# EAGLE design FIRE EXT (EAGLE 5.11)
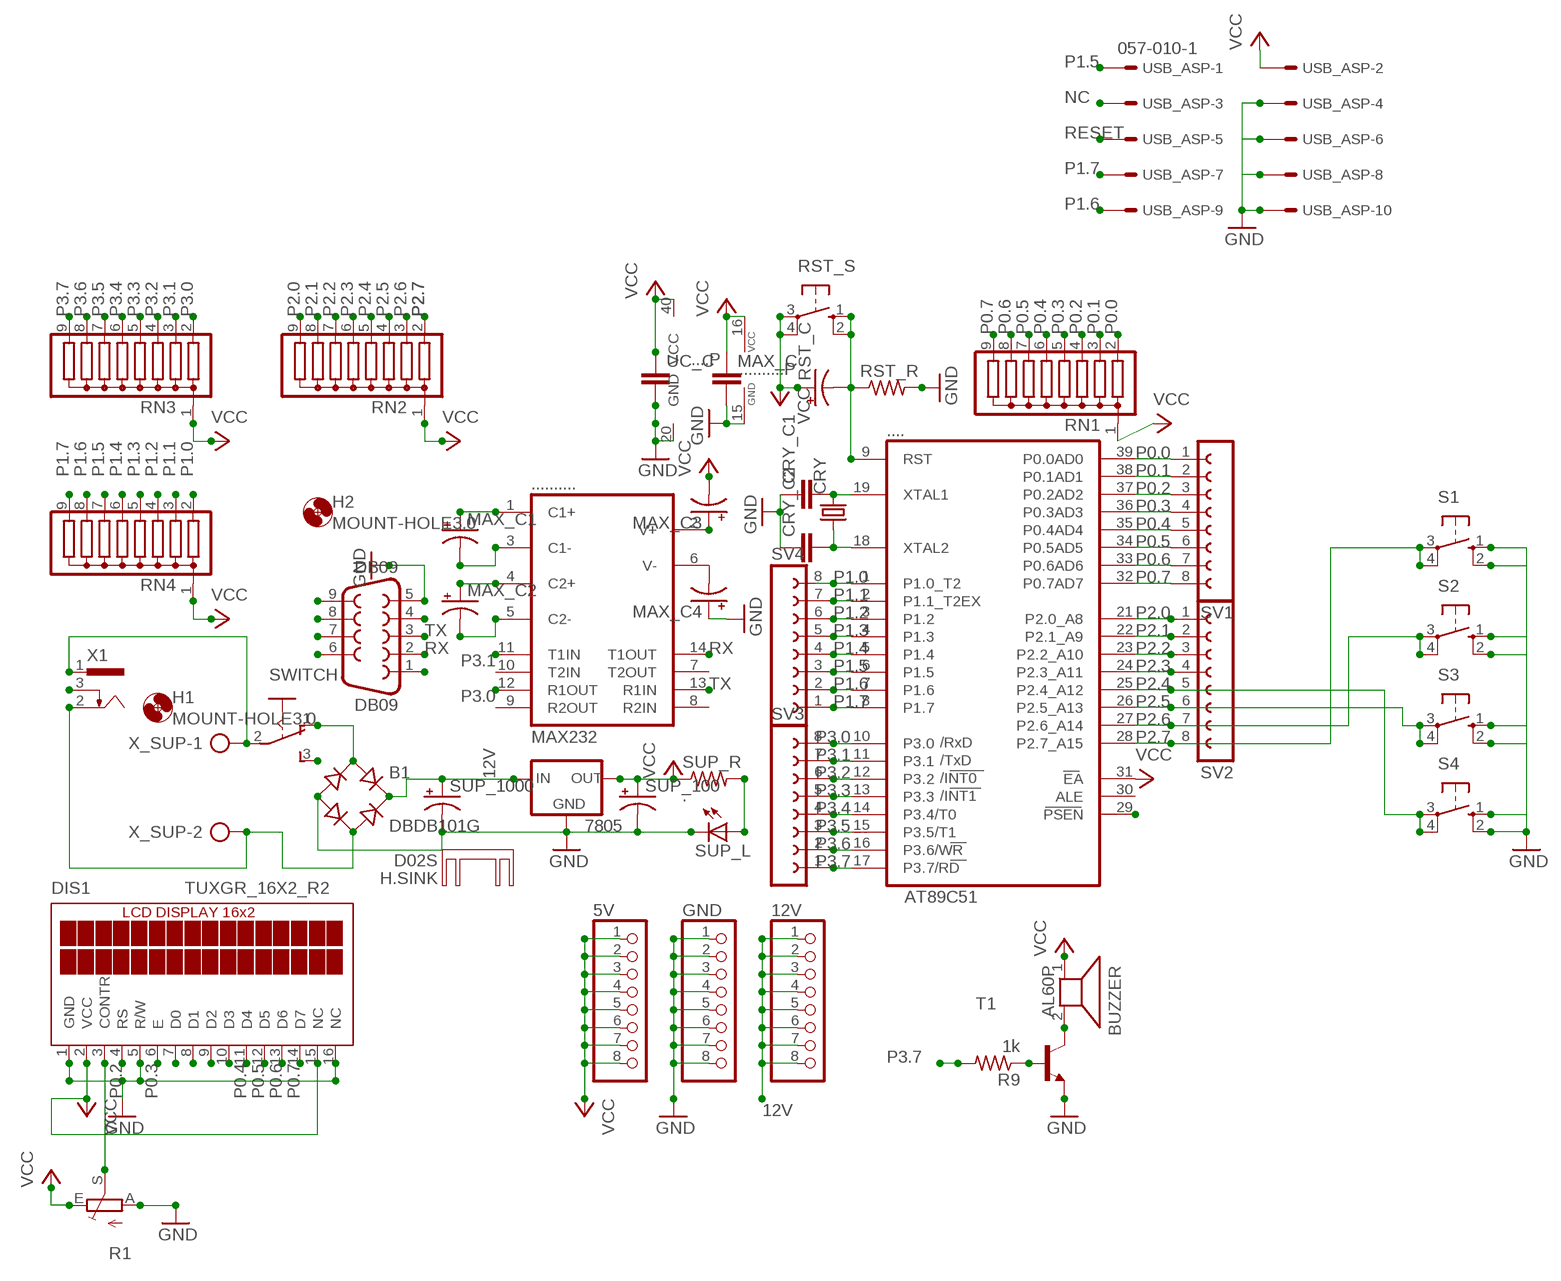
[diagram p0: schematic, sheet 1]

## Parts
5V  PINHD-1X8  [1X08]
12V  PINHD-1X8  [1X08]
7805  78XXS  [78XXS]
....  AT89C51  AT89C52P6  [DIL40]
..........  MAX232  [DIL16]
B1  DBDB101G  [DB]
BUZZER  AL60P  [AL60P]
CRY  CRYTALHC49U70  [HC49U70]
CRY_C1  C-EU025-024X044  [C025-024X044]
CRY_C2  C-EU025-024X044  [C025-024X044]
DB09  DB09  F09HP  [F09HP]
DIS1  TUXGR_16X2_R2  [TUXGR_16X2_R2]
GND  PINHD-1X8  [1X08]
H1  MOUNT-HOLE3.0  [3,0]
H2  MOUNT-HOLE3.0  [3,0]
H.SINK  D02S  [D02S]
MAX_C  C-EU025-025X050  [C025-025X050]
MAX_C1  CPOL-USE2-5  [E2-5]
MAX_C2  CPOL-USE2-5  [E2-5]
MAX_C3  CPOL-USE2-5  [E2-5]
MAX_C4  CPOL-USE2-5  [E2-5]
R1  TRIM_EU-CA9V  [CA9V]
R9  1k  R-US_0204/7  [0204/7]
RN1  G08R  [SIL9]
RN2  G08R  [SIL9]
RN3  G08R  [SIL9]
RN4  G08R  [SIL9]
RST_C  CPOL-USE2-5  [E2-5]
RST_R  R-US_0207/10  [0207/10]
RST_S  10-XX  [B3F-10XX]
S1  10-XX  [B3F-10XX]
S2  10-XX  [B3F-10XX]
S3  10-XX  [B3F-10XX]
S4  10-XX  [B3F-10XX]
SUP_100  CPOL-USE2-5  [E2-5]
SUP_1000  CPOL-USE3.5-10  [E3,5-10]
SUP_L  LED3MM  [LED3MM]
SUP_R  .  R-US_0207/10  [0207/10]
SV1  FE08-1  [FE08]
SV2  FE08-1  [FE08]
SV3  FE08-1  [FE08]
SV4  FE08-1  [FE08]
SWITCH  M251  [M251]
T1  -NPN-TO92  [TO92]
UC_C  C-EU025-025X050  [C025-025X050]
USB_ASP  057-010-1  [057-010-1]
X1  733980-62  [733980-62]
X_SUP  AK300/2  [AK300/2]

## Nets
12V: 12V.1 12V.2 12V.3 12V.4 12V.5 12V.6 12V.7 12V.8 7805.IN B1.+ SUP_1000.+
GND: 7805.GND .....20(GND) ...........15(GND) B1.- CRY_C1.1 CRY_C2.1 DB09.5 DIS1.1(GND) DIS1.5(R/W) DIS1.16(NC) GND.1 GND.2 GND.3 GND.4 GND.5 GND.6 GND.7 GND.8 MAX_C4.+ MAX_C.2 R1.A RST_R.2 S1.1(S) S1.2(S1) S2.1(S) S2.2(S1) S3.1(S) S3.2(S1) S4.1(S) S4.2(S1) SUP_100.- SUP_1000.- SUP_L.K(C) T1.1(E) UC_C.2 USB_ASP.4 USB_ASP.6 USB_ASP.8 USB_ASP.10
N$1: R9.1 T1.2(B)
N$3: BUZZER.2 T1.3(C)
N$4: ...........1(C1+) MAX_C1.+
N$5: DB09.4
N$6: DB09.1
N$7: SUP_L.A SUP_R.2
N$8: DB09.6
N$9: ...........3(C1-) MAX_C1.-
N$10: ...........4(C2+) MAX_C2.+
N$11: ...........5(C2-) MAX_C2.-
N$12: ...........2(V+) MAX_C3.+
N$13: ...........6(V-) MAX_C4.-
N$14: DB09.8
N$15: .....19(XTAL1) CRY.2 CRY_C1.2
N$16: .....18(XTAL2) CRY.1 CRY_C2.2
N$17: DB09.7
N$18: DB09.9
N$19: DIS1.7(D0)
N$20: DIS1.8(D1)
N$21: DIS1.9(D2)
N$22: DIS1.3(CONTR) R1.S
N$23: DIS1.10(D3)
N$24: SWITCH.2(P) X1.1 X_SUP.1
N$25: X1.3
N$26: B1.AC2 X1.2 X_SUP.2
N$27: B1.AC1 SWITCH.1(O)
N$28: SWITCH.3(S)
NC: USB_ASP.3
P0.0: .....39(P0.0AD0) RN1.2 SV1.1
P0.1: .....38(P0.1AD1) RN1.3 SV1.2
P0.2: .....37(P0.2AD2) DIS1.4(RS) RN1.4 SV1.3
P0.3: .....36(P0.3AD3) DIS1.6(E) RN1.5 SV1.4
P0.4: .....35(P0.4AD4) DIS1.11(D4) RN1.6 SV1.5
P0.5: .....34(P0.5AD5) DIS1.12(D5) RN1.7 SV1.6
P0.6: .....33(P0.6AD6) DIS1.13(D6) RN1.8 SV1.7
P0.7: .....32(P0.7AD7) DIS1.14(D7) RN1.9 SV1.8
P1.0: .....1(P1.0_T2) RN4.2 SV4.8
P1.1: .....2(P1.1_T2EX) RN4.3 SV4.7
P1.2: .....3(P1.2) RN4.4 SV4.6
P1.3: .....4(P1.3) RN4.5 SV4.5
P1.4: .....5(P1.4) RN4.6 SV4.4
P1.5: .....6(P1.5) RN4.7 SV4.3 USB_ASP.1
P1.6: .....7(P1.6) RN4.8 SV4.2 USB_ASP.9
P1.7: .....8(P1.7) RN4.9 SV4.1 USB_ASP.7
P2.0: .....21(P2.0_A8) RN2.9 SV2.1
P2.1: .....22(P2.1_A9) RN2.8 SV2.2
P2.2: .....23(P2.2_A10) RN2.7 SV2.3
P2.3: .....24(P2.3_A11) RN2.6 SV2.4
P2.4: .....25(P2.4_A12) RN2.5 S4.3(P) S4.4(P1) SV2.5
P2.5: .....26(P2.5_A13) RN2.4 S3.3(P) S3.4(P1) SV2.6
P2.6: .....27(P2.6_A14) RN2.3 S2.3(P) S2.4(P1) SV2.7
P2.7: .....28(P2.7_A15) RN2.2 S1.3(P) S1.4(P1) SV2.8
P3.0: .....10(P3.0) ...........12(R1OUT) RN3.2 SV3.8
P3.1: .....11(P3.1) ...........11(T1IN) RN3.3 SV3.7
P3.2: .....12(P3.2) RN3.4 SV3.6
P3.3: .....13(P3.3) RN3.5 SV3.5
P3.4: .....14(P3.4/T0) RN3.6 SV3.4
P3.5: .....15(P3.5/T1) RN3.7 SV3.3
P3.6: .....16(P3.6/WR) RN3.8 SV3.2
P3.7: .....17(P3.7/RD) R9.2 RN3.9 SV3.1
PSEN: .....29(PSEN)
RESET: .....9(RST) RST_C.- RST_R.1 RST_S.1(S) RST_S.2(S1) USB_ASP.5
RX: ...........14(T1OUT) DB09.2
TX: ...........13(R1IN) DB09.3
VCC: 5V.1 5V.2 5V.3 5V.4 5V.5 5V.6 5V.7 5V.8 7805.OUT .....31(EA) .....40(VCC) ...........16(VCC) BUZZER.1 DIS1.2(VCC) DIS1.15(NC) MAX_C3.- MAX_C.1 R1.E RN1.1 RN2.1 RN3.1 RN4.1 RST_C.+ RST_S.3(P) RST_S.4(P1) SUP_100.+ SUP_R.1 UC_C.1 USB_ASP.2
Unconnected: .....30(ALE) ...........7(T2OUT) ...........8(R2IN) ...........9(R2OUT) ...........10(T2IN)

## Library data of the parts
5V 12V GND = pinhead:PINHD-1X8: PIN HEADER
7805 = v-reg:78XXS: VOLTAGE REGULATOR
.... = atmel:AT89C*52: MICROCONTROLLER 8 Kbytes FLASH; 2K Bytes EEPROM Compatible with MCS-51 Products at89s8252.pdf; OC_FARNELL: unknown; OC_NEWARK: unknown
.......... = maxim:MAX232: RS232 TRANSEIVER; MF: MAXIM; MPN: MAX232ACPE+; OC_FARNELL: 9723773; OC_NEWARK: 68K4544
B1 = rectifier:DB?*G: Single Phase 1.0 AMP Glass Passivated Bridge Rectifier Taiwan Semiconductor Co.,Ltd. - TSC Source: http://www.taiwansemi.com/TSCbig5/ezcatfiles/cust/img/img/db101g.pdf http://www.ts.com.tw/db/pictures/modules/PDT/PDT060207001/DBLS201G.pdf
BUZZER = buzzer:AL60P: SPEAKER Source: Buerklin
CRY = crystal:CRYTAL: CRYSTAL
CRY_C1 CRY_C2 MAX_C UC_C = rcl:C-EU: CAPACITOR, European symbol
DB09 = con-subd:F09: SUB-D; OC_FARNELL: unknown; OC_NEWARK: unknown
DIS1 = display-lcd:TUXGR_16X2_R2: Tuxgraphics LCD display 16x2 characters reflective, without background light Source: tuxgr_12x2_r2.pdf; OC_FARNELL: unknown; OC_NEWARK: unknown
H1 H2 = holes:MOUNT-HOLE: MOUNTING HOLE with drill center marker
H.SINK = heatsink:D02S: HEATSINK distributor Schukat
MAX_C1-MAX_C4 RST_C SUP_100 SUP_1000 = rcl:CPOL-US: POLARIZED CAPACITOR, American symbol
R1 = pot:TRIM_EU-: POTENTIOMETER
R9 RST_R SUP_R = rcl:R-US_: RESISTOR, American symbol
RN1-RN4 = resistor-sil:G08R: SIL RESISTOR
RST_S S1-S4 = switch-omron:10-XX: OMRON SWITCH; MPN: B3F-1000; OC_FARNELL: 176432; OC_NEWARK: 36M3542
SUP_L = led:LED: LED OSRAM: - CHIPLED LG R971, LG N971, LY N971, LG Q971, LY Q971, LO R971, LY R971 LH N974, LH R974 LS Q976, LO Q976, LY Q976 LO Q996 - Hyper CHIPLED LW Q18S LB Q993, LB Q99A, LB R99A - SideLED LS A670, LO A670, LY A670, LG A670, LP A670 LB A673, LV A673, LT A673, LW A673 LH A674 LY A675 LS A676, LA A676, LO A676, LY A676, LW A676 LS A679, LY A679, LG A679 - Hyper Micro SIDELED® LS Y876, LA Y876, LO Y876, LY Y876 LT Y87S - SmartLED LW L88C, LW L88S LB L89C, LB L89S, LG L890 LS L89K, LO L89K, LY L89K LS L896, LA L896, LO L896, LY L896 - TOPLED LS T670, LO T670, LY T670, LG T670, LP T670 LSG T670, LSP T670, LSY T670, LOP T670, LYG T670 LG T671, LOG T671, LSG T671 LB T673, LV T673, LT T673, LW T673 LH T674 LS T676, LA T676, LO T676, LY T676, LB T676, LH T676, LSB T676, LW T676 LB T67C, LV T67C, LT T67C, LS T67K, LO T67K, LY T67K, LW E67C LS E67B, LA E67B, LO E67B, LY E67B, LB E67C, LV E67C, LT E67C LW T67C LS T679, LY T679, LG T679 LS T770, LO T770, LY T770, LG T770, LP T770 LB T773, LV T773, LT T773, LW T773 LH T774 LS E675, LA E675, LY E675, LS T675 LS T776, LA T776, LO T776, LY T776, LB T776 LHGB T686 LT T68C, LB T68C - Hyper Mini TOPLED® LB M676 - Mini TOPLED Santana® LG M470 LS M47K, LO M47K, LY M47K Source: http://www.osram.convergy.de LUXEON: - LUMILED® LXK2-PW12-R00, LXK2-PW12-S00, LXK2-PW14-U00, LXK2-PW14-V00 LXK2-PM12-R00, LXK2-PM12-S00, LXK2-PM14-U00 LXK2-PE12-Q00, LXK2-PE12-R00, LXK2-PE12-S00, LXK2-PE14-T00, LXK2-PE14-U00 LXK2-PB12-K00, LXK2-PB12-L00, LXK2-PB12-M00, LXK2-PB14-N00, LXK2-PB14-P00, LXK2-PB14-Q00 LXK2-PR12-L00, LXK2-PR12-M00, LXK2-PR14-Q00, LXK2-PR14-R00 LXK2-PD12-Q00, LXK2-PD12-R00, LXK2-PD12-S00 LXK2-PH12-R00, LXK2-PH12-S00 LXK2-PL12-P00, LXK2-PL12-Q00, LXK2-PL12-R00 Source: www.luxeon.com KINGBRIGHT: KA-3528ASYC Source: www.kingbright.com
SV1-SV4 = con-lsta:FE08-1: FEMALE HEADER
SWITCH = switch:M251: SLIDING SWITCH Mors, distributor Buerklin, 11G702
T1 = transistor:*-NPN-: NPN Transistror
USB_ASP = con-panduit:057-010-: CONNECTOR 10-pin series 057 contact pc board low profile headers; OC_FARNELL: unknown; OC_NEWARK: unknown
X1 = con-conrad:73398?: FEMALE PRINT CONNECTOR Niedervolt-Steckverbinder Distributor Conrad
X_SUP = con-ptr500:AK300/2: CONNECTOR

## Board
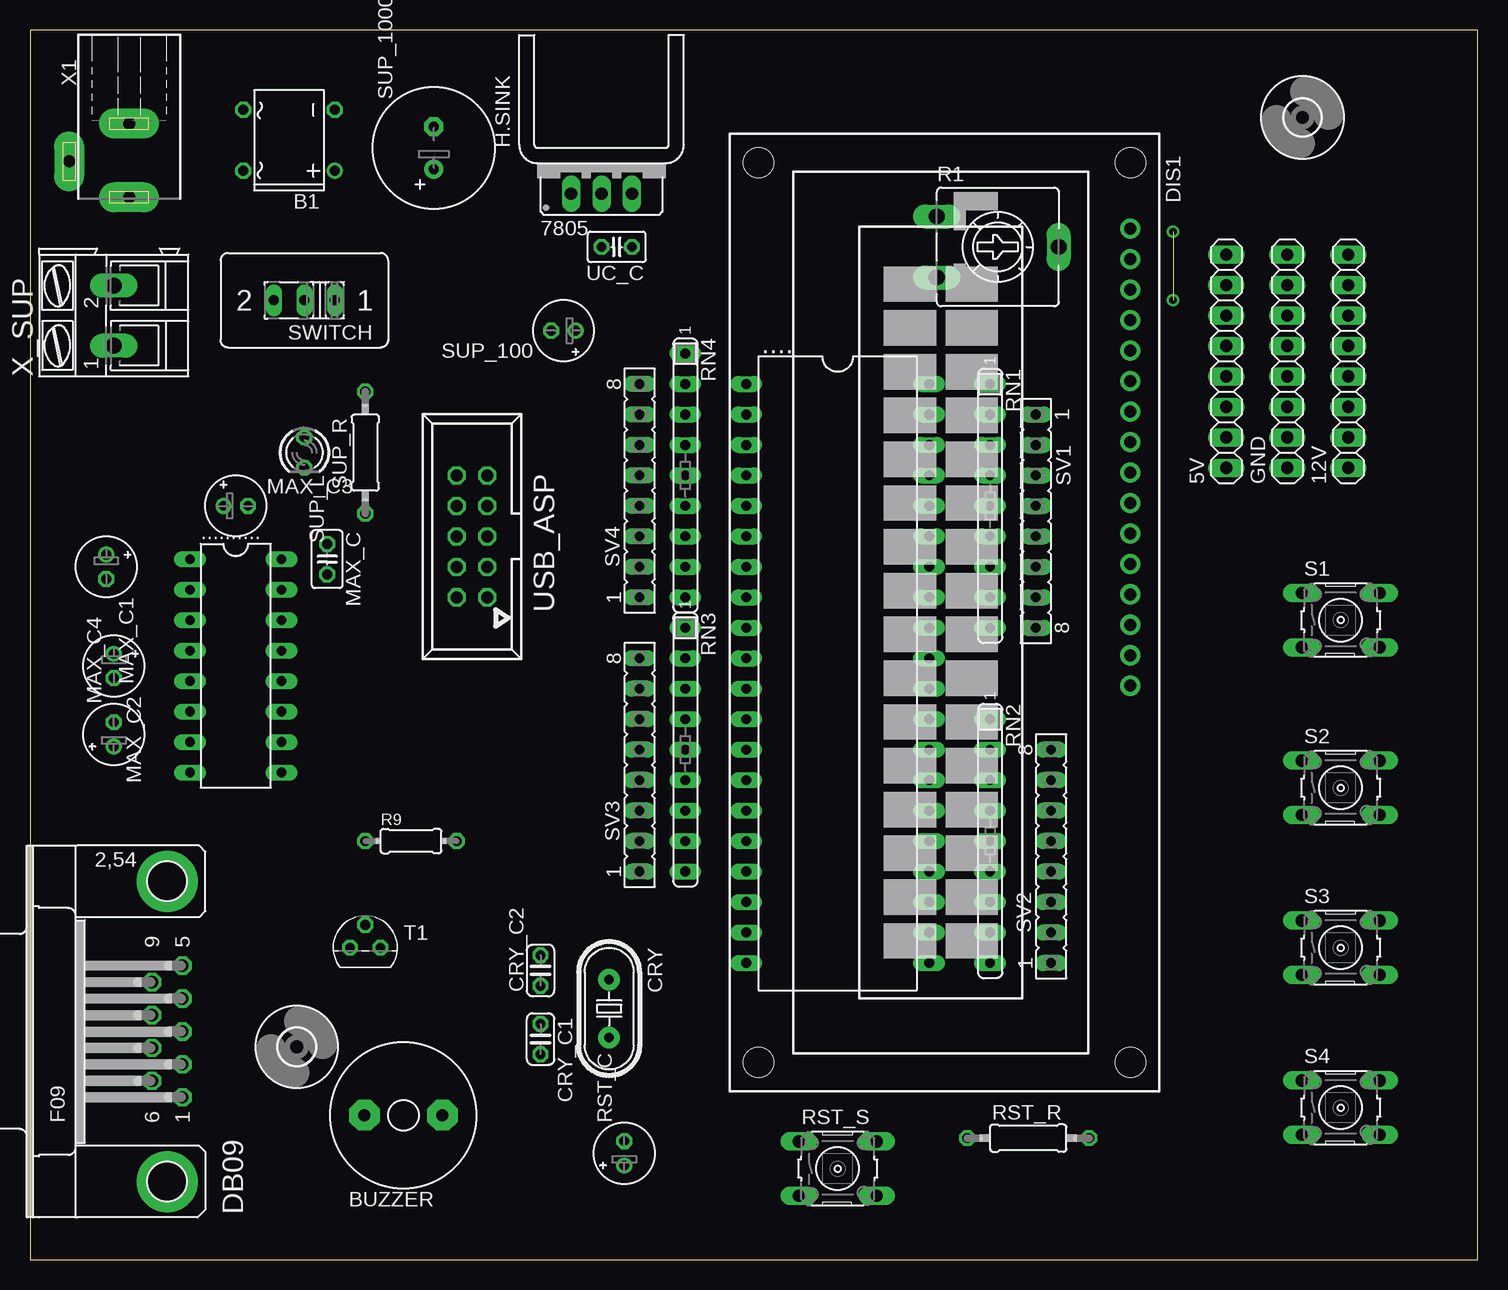
[diagram p1: board, top side]
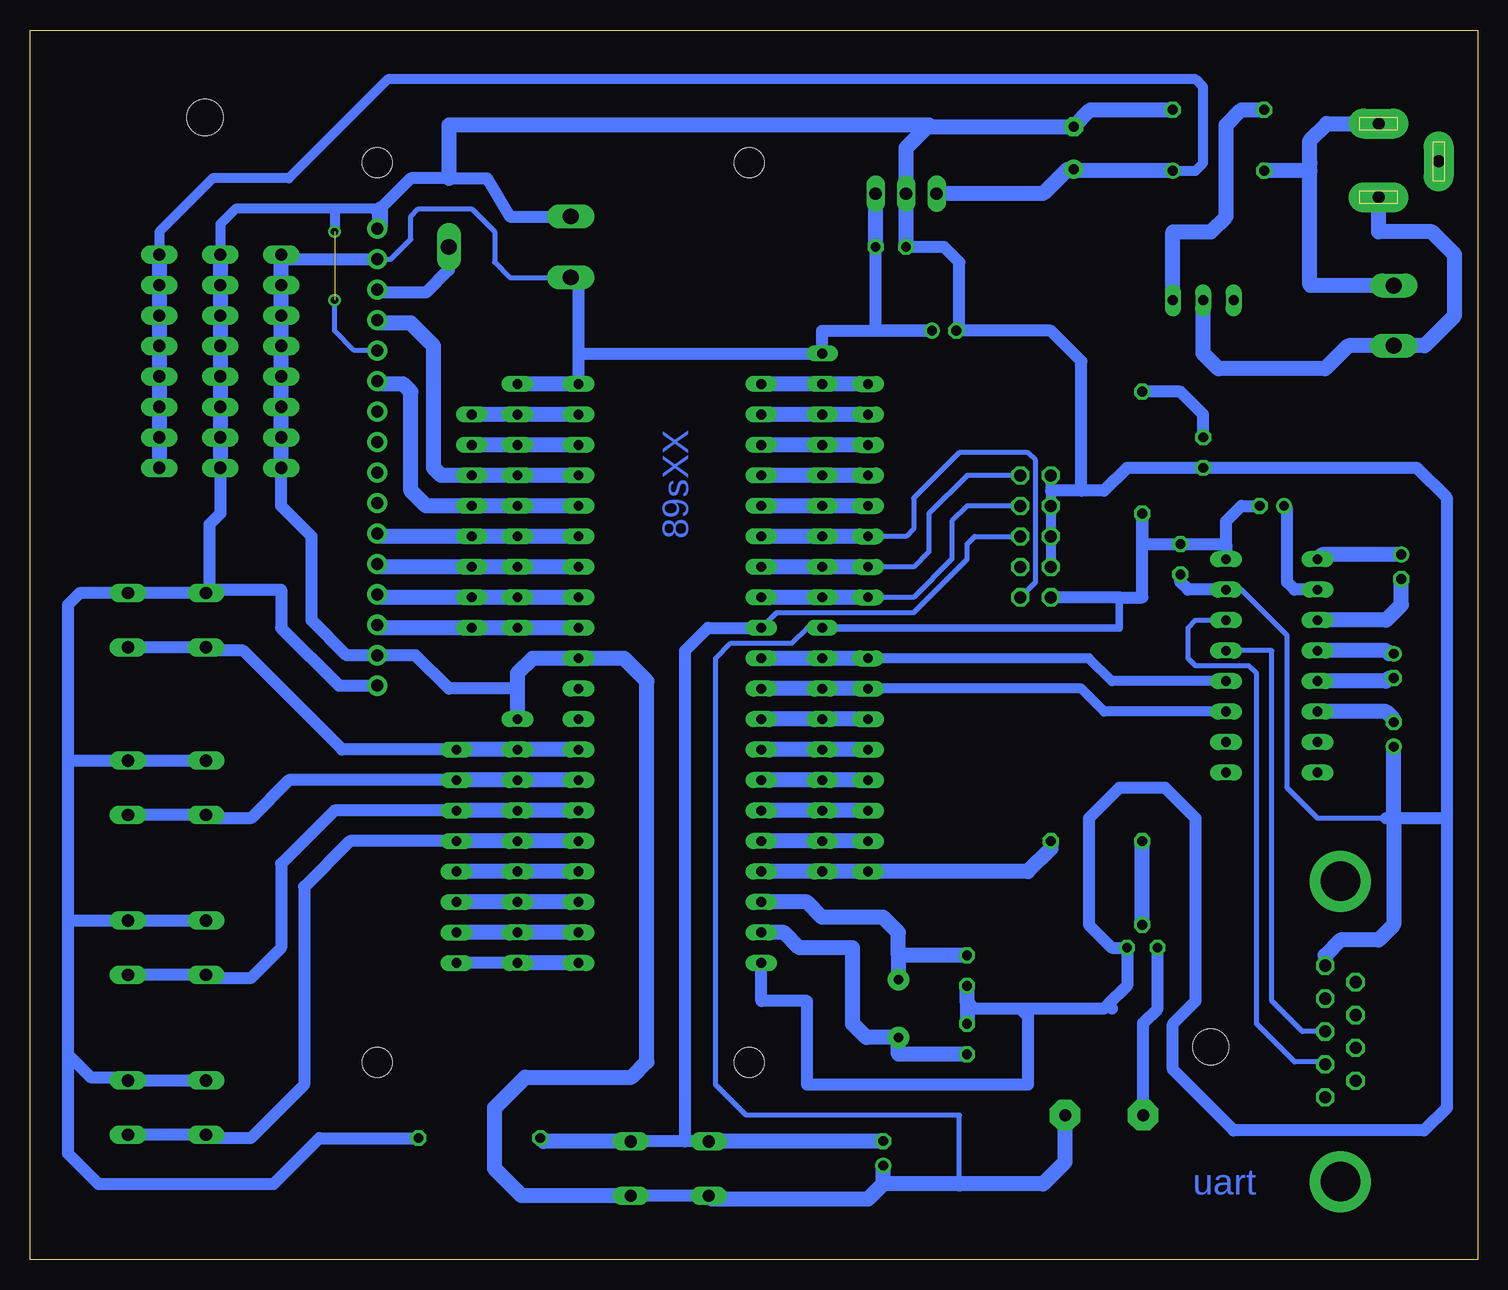
[diagram p2: board, bottom side, seen from below]

Size 120.63 x 102.54 mm. Coordinates in mm from the lower left corner, seen from the top.
Outline: 0,0 120.63,0 120.63,102.54 0,102.54 0,0
Copper layers (1*16): Top 0.035mm / dielectric 1.5mm / Bottom 0.035mm
Design rules "default *": minimum track width 22mil, minimum drill 24mil, track to track 12mil, track to pad 12mil, pad to pad 12mil, via to via 8mil, smd to smd 8mil, copper to edge 40mil, drill to drill 8mil, minimum pad ring 10mil, minimum via ring 8mil, stop-mask expansion 4mil, vias tented up to drill 0mil, thermal gap 10mil

### Footprints (pad centres in the part's own frame; a part is rotated, then mirrored left to right if it is on the bottom)
1X08 = drill 1.016 long: 1 -8.89,0; 2 -6.35,0; 3 -3.81,0; 4 -1.27,0; 5 1.27,0; 6 3.81,0; 7 6.35,0; 8 8.89,0
78XXS = drill 1.016 long: GND 0,-2.54; IN -2.54,-2.54; OUT 2.54,-2.54
DIL40 = drill 0.813 long: 1 -24.13,-7.62; 2 -21.59,-7.62; 3 -19.05,-7.62; 4 -16.51,-7.62; 5 -13.97,-7.62; 6 -11.43,-7.62; 7 -8.89,-7.62; 8 -6.35,-7.62; 9 -3.81,-7.62; 10 -1.27,-7.62; 11 1.27,-7.62; 12 3.81,-7.62; 13 6.35,-7.62; 14 8.89,-7.62; 15 11.43,-7.62; 16 13.97,-7.62; 17 16.51,-7.62; 18 19.05,-7.62; 19 21.59,-7.62; 20 24.13,-7.62; 21 24.13,7.62; 22 21.59,7.62; 23 19.05,7.62; 24 16.51,7.62; 25 13.97,7.62; 26 11.43,7.62; 27 8.89,7.62; 28 6.35,7.62; 29 3.81,7.62; 30 1.27,7.62; 31 -1.27,7.62; 32 -3.81,7.62; 33 -6.35,7.62; 34 -8.89,7.62; 35 -11.43,7.62; 36 -13.97,7.62; 37 -16.51,7.62; 38 -19.05,7.62; 39 -21.59,7.62; 40 -24.13,7.62
DIL16 = drill 0.813 long: 1 -8.89,-3.81; 2 -6.35,-3.81; 3 -3.81,-3.81; 4 -1.27,-3.81; 5 1.27,-3.81; 6 3.81,-3.81; 7 6.35,-3.81; 8 8.89,-3.81; 9 8.89,3.81; 10 6.35,3.81; 11 3.81,3.81; 12 1.27,3.81; 13 -1.27,3.81; 14 -3.81,3.81; 15 -6.35,3.81; 16 -8.89,3.81
DB = drill 0.813 round: + -2.54,-3.81 | drill 0.813 octagon: - 2.54,-3.81; AC1 2.54,3.81; AC2 -2.54,3.81
AL60P = drill 1.016 pad 2.54 octagon: 1 -3.251,0; 2 3.251,0
HC49U70 = drill 0.813 pad 1.778 round: 1 -2.413,0; 2 2.413,0
C025-024X044 = drill 0.813 octagon: 1 -1.27,0; 2 1.27,0
F09HP = drill 1.016 octagon: 1 -5.486,-1.27; 2 -2.743,-1.27; 3 0,-1.27; 4 2.743,-1.27; 5 5.486,-1.27; 6 -4.115,1.27; 7 -1.372,1.27; 8 1.372,1.27; 9 4.115,1.27 | drill 3.302 pad 5.08 round: G1 -12.522,0; G2 12.522,0
TUXGR_16X2_R2 = drill 1 pad 1.676 round: 1 -32,15.5; 2 -29.46,15.5; 3 -26.92,15.5; 4 -24.38,15.5; 5 -21.84,15.5; 6 -19.3,15.5; 7 -16.76,15.5; 8 -14.22,15.5; 9 -11.68,15.5; 10 -9.14,15.5; 11 -6.6,15.5; 12 -4.06,15.5; 13 -1.52,15.5; 14 1.02,15.5; 15 3.56,15.5; 16 6.1,15.5 | hole 2.5: -37.5,-15.5; 37.5,-15.5; -37.5,15.5; 37.5,15.5
3,0 = hole 3: 0,0
C025-025X050 = drill 0.813 octagon: 1 -1.27,0; 2 1.27,0
E2-5 = drill 0.813 pad 1.27 round: + -1.016,0 | drill 0.813 pad 1.27 octagon: - 1.016,0
CA9V = drill 1.321 long: A -2.54,-5.08; E 2.54,-5.08; S 0,5.08
0204/7 = drill 0.813 octagon: 1 -3.81,0; 2 3.81,0
SIL9 = drill 0.813 long: 1 -10.16,0; 2 -7.62,0; 3 -5.08,0; 4 -2.54,0; 5 0,0; 6 2.54,0; 7 5.08,0; 8 7.62,0; 9 10.16,0
0207/10 = drill 0.813 octagon: 1 -5.08,0; 2 5.08,0
B3F-10XX = drill 1.016 long: 1 -3.251,2.261; 2 3.251,2.261; 3 -3.251,-2.261; 4 3.251,-2.261
E3,5-10 = drill 0.813 pad 1.6 round: + -1.778,0 | drill 0.813 pad 1.6 octagon: - 1.778,0
LED3MM = drill 0.813 octagon: A -1.27,0; K 1.27,0
FE08 = drill 0.813 long: 1 -8.89,0; 2 -6.35,0; 3 -3.81,0; 4 -1.27,0; 5 1.27,0; 6 3.81,0; 7 6.35,0; 8 8.89,0
M251 = drill 0.813 long: 1 -2.54,0; 2 0,0; 3 2.54,0
TO92 = drill 0.813 octagon: 1 1.27,0; 2 0,1.905; 3 -1.27,0
057-010-1 = drill 1 octagon: 1 -5.08,-1.27; 2 -5.08,1.27; 3 -2.54,-1.27; 4 -2.54,1.27; 5 0,-1.27; 6 0,1.27; 7 2.54,-1.27; 8 2.54,1.27; 9 5.08,-1.27; 10 5.08,1.27
733980-62 = drill 1 pad 2.5 long: 1 0,8.57; 2 0,2.42; 3 5,5.57
AK300/2 = drill 1.321 long: 1 -2.515,0; 2 2.489,0

### Placement (x,y rotation side)
5V  99.69,74.93 90 top
12V  109.86,74.93 90 top
7805  47.62,91.44 0 top
....  67.31,48.89 270 top
..........  17.14,49.53 270 top
B1  21.59,93.35 90 top
BUZZER  31.12,12.07 180 top
CRY  48.26,20.95 270 top
CRY_C1  42.55,18.41 270 top
CRY_C2  42.55,24.13 90 top
DB09  11.43,19.05 90 top
DIS1  76.2,53.98 270 top
GND  104.78,74.93 90 top
H1  106.05,95.25 0 top
H2  22.23,17.78 0 top
H.SINK  47.62,92.71 0 top
MAX_C  24.77,58.42 270 top
MAX_C1  6.35,57.78 270 top
MAX_C2  6.98,49.53 270 top
MAX_C3  17.14,62.87 0 top
MAX_C4  6.98,43.81 90 top
R1  80.64,84.46 270 top
R9  31.75,34.92 0 top
RN1  80.01,62.87 270 top
RN2  80.01,34.92 270 top
RN3  54.61,42.55 270 top
RN4  54.61,65.41 270 top
RST_C  49.53,8.89 90 top
RST_R  83.19,10.16 0 top
RST_S  67.31,7.62 0 top
S1  109.22,53.34 0 top
S2  109.22,39.37 0 top
S3  109.22,26.04 0 top
S4  109.22,12.7 0 top
SUP_100  44.45,77.47 180 top
SUP_1000  33.66,92.71 90 top
SUP_L  22.86,67.31 270 top
SUP_R  27.94,67.31 90 top
SV1  83.82,61.59 270 top
SV2  85.09,33.66 90 top
SV3  50.8,41.27 90 top
SV4  50.8,64.14 90 top
SWITCH  22.86,80.01 180 top
T1  27.94,26.04 0 top
UC_C  48.9,84.46 180 top
USB_ASP  36.83,60.32 90 top
X1  8.25,97.16 180 top
X_SUP  6.98,78.74 90 top

### Tracks (layer width: path | path; a pad name or v marks a point on that pad's centre or on a via)
12V
  Bottom 0.813: 12V.8 109.86,85.73 105.41,90.17 99.06,90.17 90.81,98.43 23.5,98.43 22.86,97.79 22.86,91.44 23.5,90.81 B1.+
  Bottom 1.27: B1.+ 33.53,90.81 SUP_1000.+ 34.16,90.93 36.2,88.9 7805.IN | 12V.8 12V.7 12V.6 12V.5 12V.4 12V.3 12V.2 12V.1
GND  (via drill 0.6 pad 1.02)  (1 unrouted)
  Bottom 0.406: ...........15 19.68,55.88 15.88,52.07 15.88,39.37 13.34,36.83 7.62,36.83 6.98,36.83 | DIS1.5 93.59,75.82 95.25,77.47 v95.25,80.01
  Bottom 0.813: USB_ASP.4 USB_ASP.6 USB_ASP.8 35.56,64.14 USB_ASP.10 | 92.08,87.63 91.44,87.63 91.7,87.37 DIS1.1 91.7,87.26 92.08,87.63 | 95.25,87.63 103.5,87.63 104.78,86.36 GND.8 | 92.08,87.63 95.25,87.63 | 95.25,87.63 95.25,85.73
  Bottom 1.016: ...........15 24.13,55.88 24.77,56.52 MAX_C.2 | 33.02,64.14 31.12,64.14 29.21,66.04 SUP_L.K 5.08,66.04 2.54,63.5 2.54,36.83 | 33.02,64.14 35.56,64.14 | 2.54,36.83 7.62,36.83 | UC_C.2 44.45,84.46 43.18,83.19 43.18,77.72 SUP_100.- 35.56,77.47 33.02,74.93 33.02,64.14 | 30.8,21.27 29.21,22.86 T1.1 30.48,26.04 32.39,27.94 32.39,36.83 29.84,39.37 26.04,39.37 23.5,36.83 23.5,21.59 25.4,19.68 25.4,15.88 20.32,10.8 4.45,10.8 2.54,12.7 2.54,36.83 | 30.8,21.27 31.12,20.95 38.1,20.95 | 38.1,20.95 41.91,20.95 42.55,21.59 | .....20 59.69,21.59 55.88,21.59 55.88,14.61 37.47,14.61 37.47,20.32 38.1,20.95 | 30.8,21.27 30.48,20.95 | R1.A 80.64,87 82.55,90.17 85.72,90.17 88.9,90.17 91.44,87.63 | S2.1 S2.2 117.12,41.63 117.47,41.27 | S3.1 S3.2 117.2,28.3 117.47,28.57 | S4.1 S4.2 112.75,15.24 115.57,15.24 117.47,17.14 | 117.47,28.57 117.47,17.14 | 117.47,41.27 117.47,28.57 | 117.47,41.27 117.47,54.61 116.48,55.6 S1.2 S1.1 105.69,55.88 | DIS1.16 94.86,47.88 99.69,52.7 99.69,55.88 105.69,55.88 | 105.69,55.88 105.69,61.32 104.78,62.23 GND.1 | RST_R.2 96.52,10.16 100.33,6.35 114.94,6.35 117.47,8.89 117.47,17.14
  Bottom 1.27: B1.- 32.26,95.89 SUP_1000.- 45.85,94.49 | 45.85,94.49 47.62,92.71 7805.GND UC_C.2 | GND.8 GND.7 GND.6 GND.5 GND.4 | GND.4 104.78,73.03 | GND.4 GND.3 GND.2 GND.1 | DB09.5 12.7,25.4 11.43,26.67 8.25,26.67 6.98,27.94 6.98,36.83 MAX_C4.+ | CRY_C1.1 42.55,21.59 CRY_C2.1 | 45.85,94.49 45.72,94.62 85.72,94.62 85.72,90.17 | 91.44,87.63 91.44,86.23 DIS1.1
N$1
  Bottom 1.27: T1.2 R9.1
N$2  (via drill 0.6 pad 1.02)
  other vias: 95.25,85.73
N$3
  Bottom 1.016: BUZZER.2 27.86,19.76 26.67,20.95 T1.3
N$4
  Bottom 1.27: MAX_C1.+ 12.95,58.8 ...........1
N$7
  Bottom 1.016: SUP_L.A 22.86,70.48 24.77,72.39 SUP_R.2
N$9
  Bottom 1.27: MAX_C1.- 6.35,54.61 7.62,53.34 ...........3
N$10
  Bottom 1.27: MAX_C2.+ 7.37,50.55 7.62,50.8 ...........4
N$11
  Bottom 1.27: MAX_C2.- 7.37,48.51 7.62,48.26 ...........5
N$12
  Bottom 1.016: ...........2 15.24,55.88 15.88,56.52 15.88,62.61 MAX_C3.+
N$13
  Bottom 1.27: MAX_C4.- 6.98,45.09 7.62,45.72 ...........6
N$15
  Bottom 1.27: .....19 57.78,27.3 56.52,26.04 52.07,26.04 52.07,19.68 50.93,18.54 CRY.2 48.26,17.14 CRY_C1.2
N$16
  Bottom 1.27: .....18 55.88,29.84 54.61,28.57 49.53,28.57 48.26,27.3 48.26,25.4 | 48.26,25.4 CRY.1 | CRY_C2.2 48.26,25.4
N$22
  Bottom 1.016: R1.S 85.72,82.55 87.63,80.65 91.45,80.65 DIS1.3
N$24
  Bottom 1.27: SWITCH.2 22.86,75.57 21.59,74.3 12.7,74.3 10.77,76.23 X_SUP.1 4.42,76.23 1.9,78.74 1.9,83.82 3.81,85.73 8.25,85.73 X1.1
N$26
  Bottom 1.27: X1.2 12.58,94.73 13.97,93.35 13.97,91.44 13.97,90.81 | 13.97,90.81 B1.AC2 | X_SUP.2 13.92,81.23 13.97,81.28 13.97,90.81
N$27
  Bottom 1.27: B1.AC1 19.68,95.89 20.95,94.62 20.95,87 22.23,85.73 25.4,85.73 SWITCH.1
P0.0
  Bottom 1.27: .....39 RN1.2 SV1.1
P0.1
  Bottom 1.27: SV1.2 RN1.3 .....38
P0.2
  Bottom 1.27: .....37 RN1.4 SV1.3 86.36,65.41 87,66.04 87,76.2 88.9,78.11 91.45,78.11 DIS1.4
P0.3
  Bottom 1.27: .....36 RN1.5 SV1.4 87.63,62.87 88.9,64.14 88.9,72.39 89.53,73.03 91.45,73.03 DIS1.6
P0.4
  Bottom 1.27: .....35 RN1.6 SV1.5 | SV1.5 84.45,60.32 | SV1.5 91.45,60.32 DIS1.11
P0.5
  Bottom 1.27: .....34 RN1.7 SV1.6 91.45,57.78 DIS1.12
P0.6
  Bottom 1.27: .....33 RN1.8 SV1.7 91.45,55.24 DIS1.13
P0.7
  Bottom 1.27: .....32 RN1.9 SV1.8 91.45,52.7 DIS1.14
P1.0
  Bottom 1.27: SV4.8 RN4.2 .....1
P1.1
  Bottom 1.27: .....2 RN4.3 SV4.7
P1.2
  Bottom 1.27: SV4.6 RN4.4 .....3
P1.3
  Bottom 1.27: .....4 RN4.5 SV4.5
P1.4
  Bottom 1.27: .....5 RN4.6 SV4.4
P1.5
  Bottom 0.406: USB_ASP.1 36.83,56.52 36.83,66.68 37.47,67.31 43.18,67.31 46.99,63.5 46.99,60.96 47.62,60.32 SV4.3
  Bottom 1.27: .....6 RN4.7 SV4.3
P1.6
  Bottom 0.406: USB_ASP.9 42.55,65.41 45.72,62.23 45.72,59.05 46.99,57.78 SV4.2
  Bottom 1.27: .....7 RN4.8 SV4.2
P1.7
  Bottom 0.406: USB_ASP.7 42.55,62.87 43.81,61.59 43.81,58.42 46.99,55.24 51.44,55.24
  Bottom 1.27: SV4.1 51.44,55.24 RN4.9 .....8
P2.0
  Bottom 1.016: RN2.9 SV2.1
  Bottom 1.27: .....21 RN2.9
P2.1
  Bottom 1.27: SV2.2 RN2.8 .....22
P2.2
  Bottom 1.27: .....23 RN2.7 SV2.3
P2.3
  Bottom 1.27: .....24 RN2.6 SV2.4
P2.4
  Bottom 1.016: SV2.5 93.98,34.92 97.79,31.11 97.79,14.61 102.23,10.16 105.69,10.16 S4.3 S4.4
  Bottom 1.27: .....25 RN2.5 SV2.5
P2.5
  Bottom 1.016: SV2.6 95.25,37.46 99.69,33.02 99.69,26.04 102.23,23.49 105.69,23.49 S3.3 S3.4
  Bottom 1.27: .....26 RN2.4 SV2.6
P2.6
  Bottom 1.016: SV2.7 99.06,40.01 102.23,36.83 105.69,36.83 S2.3 S2.4
  Bottom 1.27: .....27 RN2.3 | RN2.3 80.64,40.01 | RN2.3 SV2.7
P2.7
  Bottom 1.016: SV2.8 94.61,42.55 102.87,50.8 105.69,50.8 S1.3 S1.4
  Bottom 1.27: .....28 RN2.2 SV2.8
P3.0
  Bottom 0.813: ...........12 30.48,48.26 32.39,50.16 SV3.8
  Bottom 1.27: SV3.8 RN3.2 .....10
P3.1
  Bottom 0.813: SV3.7 33.02,47.62 31.12,45.72 ...........11
  Bottom 1.27: .....11 RN3.3 SV3.7
P3.2
  Bottom 1.27: SV3.6 RN3.4 .....12
P3.3
  Bottom 1.27: .....13 RN3.5 SV3.5
P3.4
  Bottom 1.27: SV3.4 RN3.6 .....14
P3.5
  Bottom 1.27: .....15 RN3.7 SV3.3
P3.6
  Bottom 1.27: SV3.2 RN3.8 .....16
P3.7
  Bottom 1.27: .....17 RN3.9 51.44,32.38 SV3.1 37.47,32.38 35.56,34.29 R9.2
RESET
  Bottom 0.406: USB_ASP.5 41.91,60.32 42.55,59.69 42.55,58.42 46.99,53.98 58.42,53.98 .....9
  Bottom 1.016: .....9 64.13,52.7 66.04,50.8 66.04,9.88 | RST_S.1 66.04,9.88 | 66.04,9.88 RST_S.2
  Bottom 1.27: RST_C.- 64.03,9.91 RST_S.1 | RST_S.2 77.83,9.88 RST_R.1
RX
  Bottom 0.406: ...........14 23.5,53.34 24.13,52.7 24.13,50.16 23.5,49.53 19.05,49.53 18.41,48.89 18.41,19.68 15.24,16.51 12.9,16.51 DB09.2
TX
  Bottom 0.406: ...........13 17.14,50.8 17.14,21.59 14.61,19.05 DB09.3
VCC
  Bottom 0.406: DIS1.2 90.56,83.44 88.9,85.09 88.9,87 88.27,87.63 83.82,87.63 81.92,85.73 81.92,83.19 80.64,81.92 R1.E | RN3.1 55.88,52.7 57.15,51.44 62.23,51.44 63.5,50.16 63.5,14.61 60.96,12.07 43.18,12.07 43.18,6.35
  Bottom 0.61: RN3.1 29.84,52.7 29.84,55.24
  Bottom 1.016: MAX_C3.- 19.68,62.87 20.95,61.59 20.95,59.69 | 20.95,59.69 ...........16 | 20.95,59.69 MAX_C.1 27.94,59.69 SUP_R.1 27.94,55.24 29.84,55.24 USB_ASP.2 | UC_C.1 50.16,77.47 SUP_100.+ 54.61,77.47 RN4.1 74.93,75.57 | 74.93,75.57 .....40 | 5V.1 99.69,62.87 97.16,60.32 97.16,53.34 94.23,50.41 DIS1.15 88.52,50.41 85.72,47.62 80.01,47.62 | RST_S.3 RST_S.4 | 74.93,75.57 74.93,81.28 R1.E | DIS1.2 99.31,83.44 5V.8
  Bottom 1.27: UC_C.1 7805.OUT | .....40 RN1.1 | RN2.1 80.01,47.62 80.01,48.89 78.74,50.16 .....31 71.12,50.16 69.22,48.26 69.22,16.51 70.48,15.24 79.38,15.24 81.92,12.7 81.92,7.62 79.65,5.36 RST_S.4 | 5V.8 5V.7 5V.6 5V.5 5V.4 5V.3 5V.2 5V.1 | 49.53,6.35 RST_C.+ | 49.53,6.35 50.8,5.08 63.78,5.08 RST_S.3 | BUZZER.1 34.37,8.18 36.2,6.35 43.18,6.35 49.53,6.35

### Text on the board
Bottom: 89sXX | uart